# EAGLE schematic sensor (EAGLE 6.4)
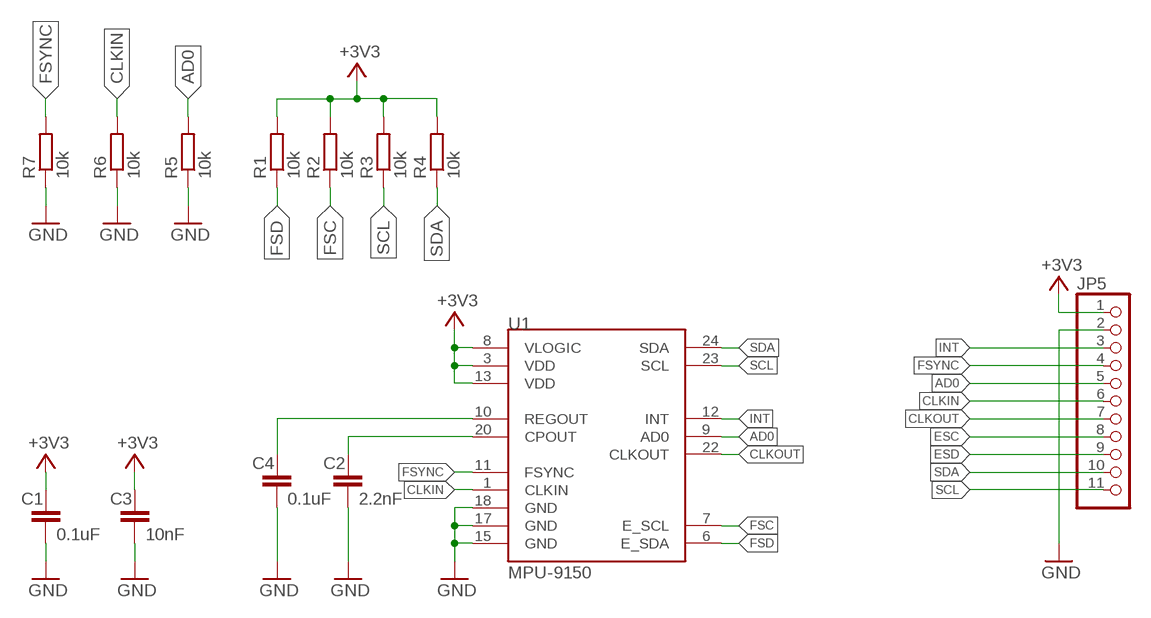
[diagram p0: schematic, sheet 1]

## Parts
C1  0.1uF  C-EUC1206K  [C1206K]
C2  2.2nF  C-EUC1206K  [C1206K]
C3  10nF  C-EUC1206K  [C1206K]
C4  0.1uF  C-EUC1206K  [C1206K]
JP5  PINHD-1X11  [1X11]
R1  10k  R-EU_R1206  [R1206]
R2  10k  R-EU_R1206  [R1206]
R3  10k  R-EU_R1206  [R1206]
R4  10k  R-EU_R1206  [R1206]
R5  10k  R-EU_R1206  [R1206]
R6  10k  R-EU_R1206  [R1206]
R7  10k  R-EU_R1206  [R1206]
U1  MPU-9150  MPU-9150QFN-24-NP  [QFN-24-NP]

## Nets
+3V3: C1.1 C3.1 JP5.1 R1.2 R2.2 R3.2 R4.2 U1.3(VDD) U1.8(VLOGIC) U1.13(VDD)
AD0: JP5.5 R5.2 U1.9(AD0)
CLKIN: JP5.6 R6.2 U1.1(CLKIN)
CLKOUT: JP5.7 U1.22(CLKOUT)
ESC: JP5.8
ESD: JP5.9
FSC: R2.1 U1.7(E_SCL)
FSD: R1.1 U1.6(E_SDA)
FSYNC: JP5.4 R7.2 U1.11(FSYNC)
GND: C1.2 C2.2 C3.2 C4.2 JP5.2 R5.1 R6.1 R7.1 U1.15(GND) U1.17(GND) U1.18(GND)
INT: JP5.3 U1.12(INT)
N$1: C2.1 U1.20(CPOUT)
N$2: C4.1 U1.10(REGOUT)
SCL: JP5.11 R3.1 U1.23(SCL)
SDA: JP5.10 R4.1 U1.24(SDA)

## Library data of the parts
C1-C4 = rcl:C-EU: CAPACITOR, European symbol
JP5 = pinhead:PINHD-1X11: PIN HEADER
R1-R7 = rcl:R-EU_: RESISTOR, European symbol
U1 = SparkFun-Sensors:MPU-9150: 9DOF (3mag, 3accel, 3rotat). I2C interface.